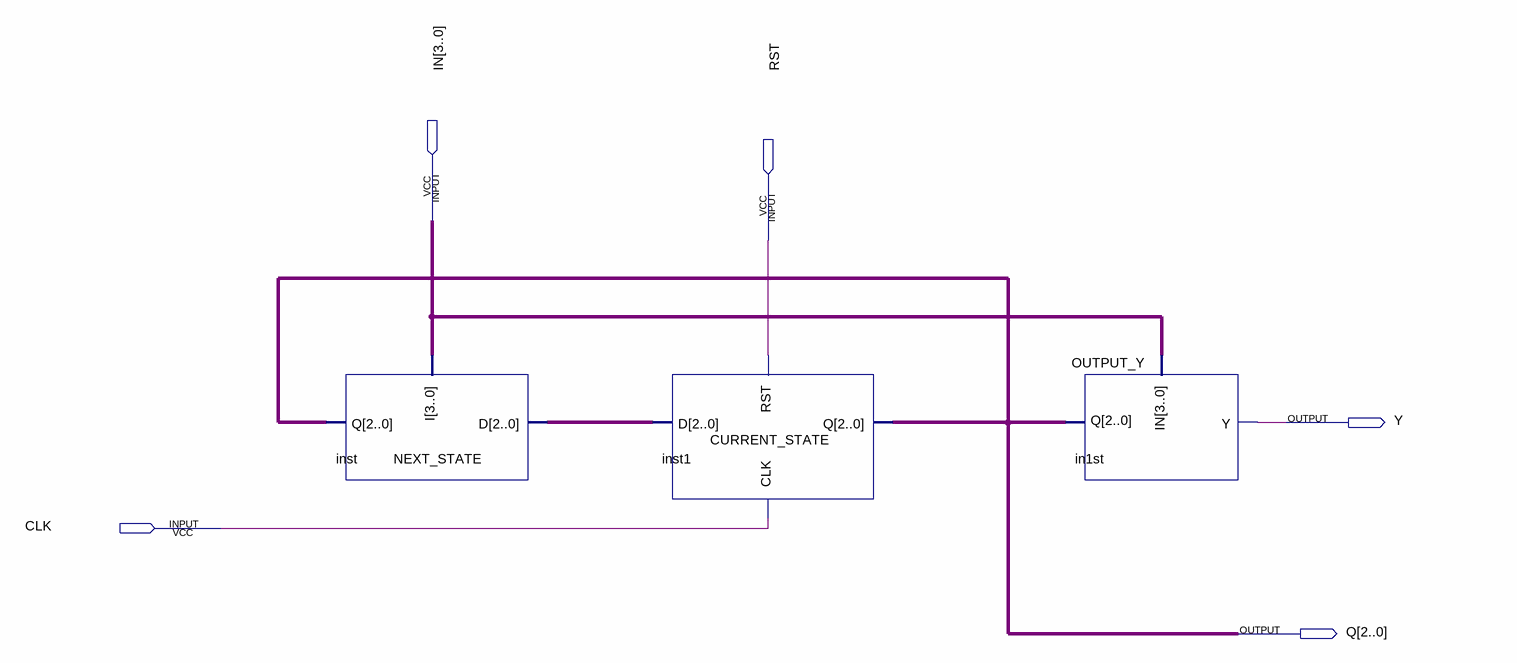
[diagram p0: schematic sheet]
// Quartus schematic MSSV.bdf as structural Verilog: 3 symbols, 5 pins
module MSSV (
  input  [3:0] IN,
  input  RST,
  input  CLK,
  output Y,
  output [2:0] Q
);

  wire [2:0] inst_d;

  NEXT_STATE inst (.I(IN), .Q(Q), .D(inst_d));
  CURRENT_STATE inst1 (.D(inst_d), .CLK(CLK), .RST(RST), .Q(Q));
  OUTPUT_Y in1st (.Q(Q), .IN(IN), .Y(Y));
endmodule
